# EAGLE schematic duikboot (EAGLE 9.5.2)
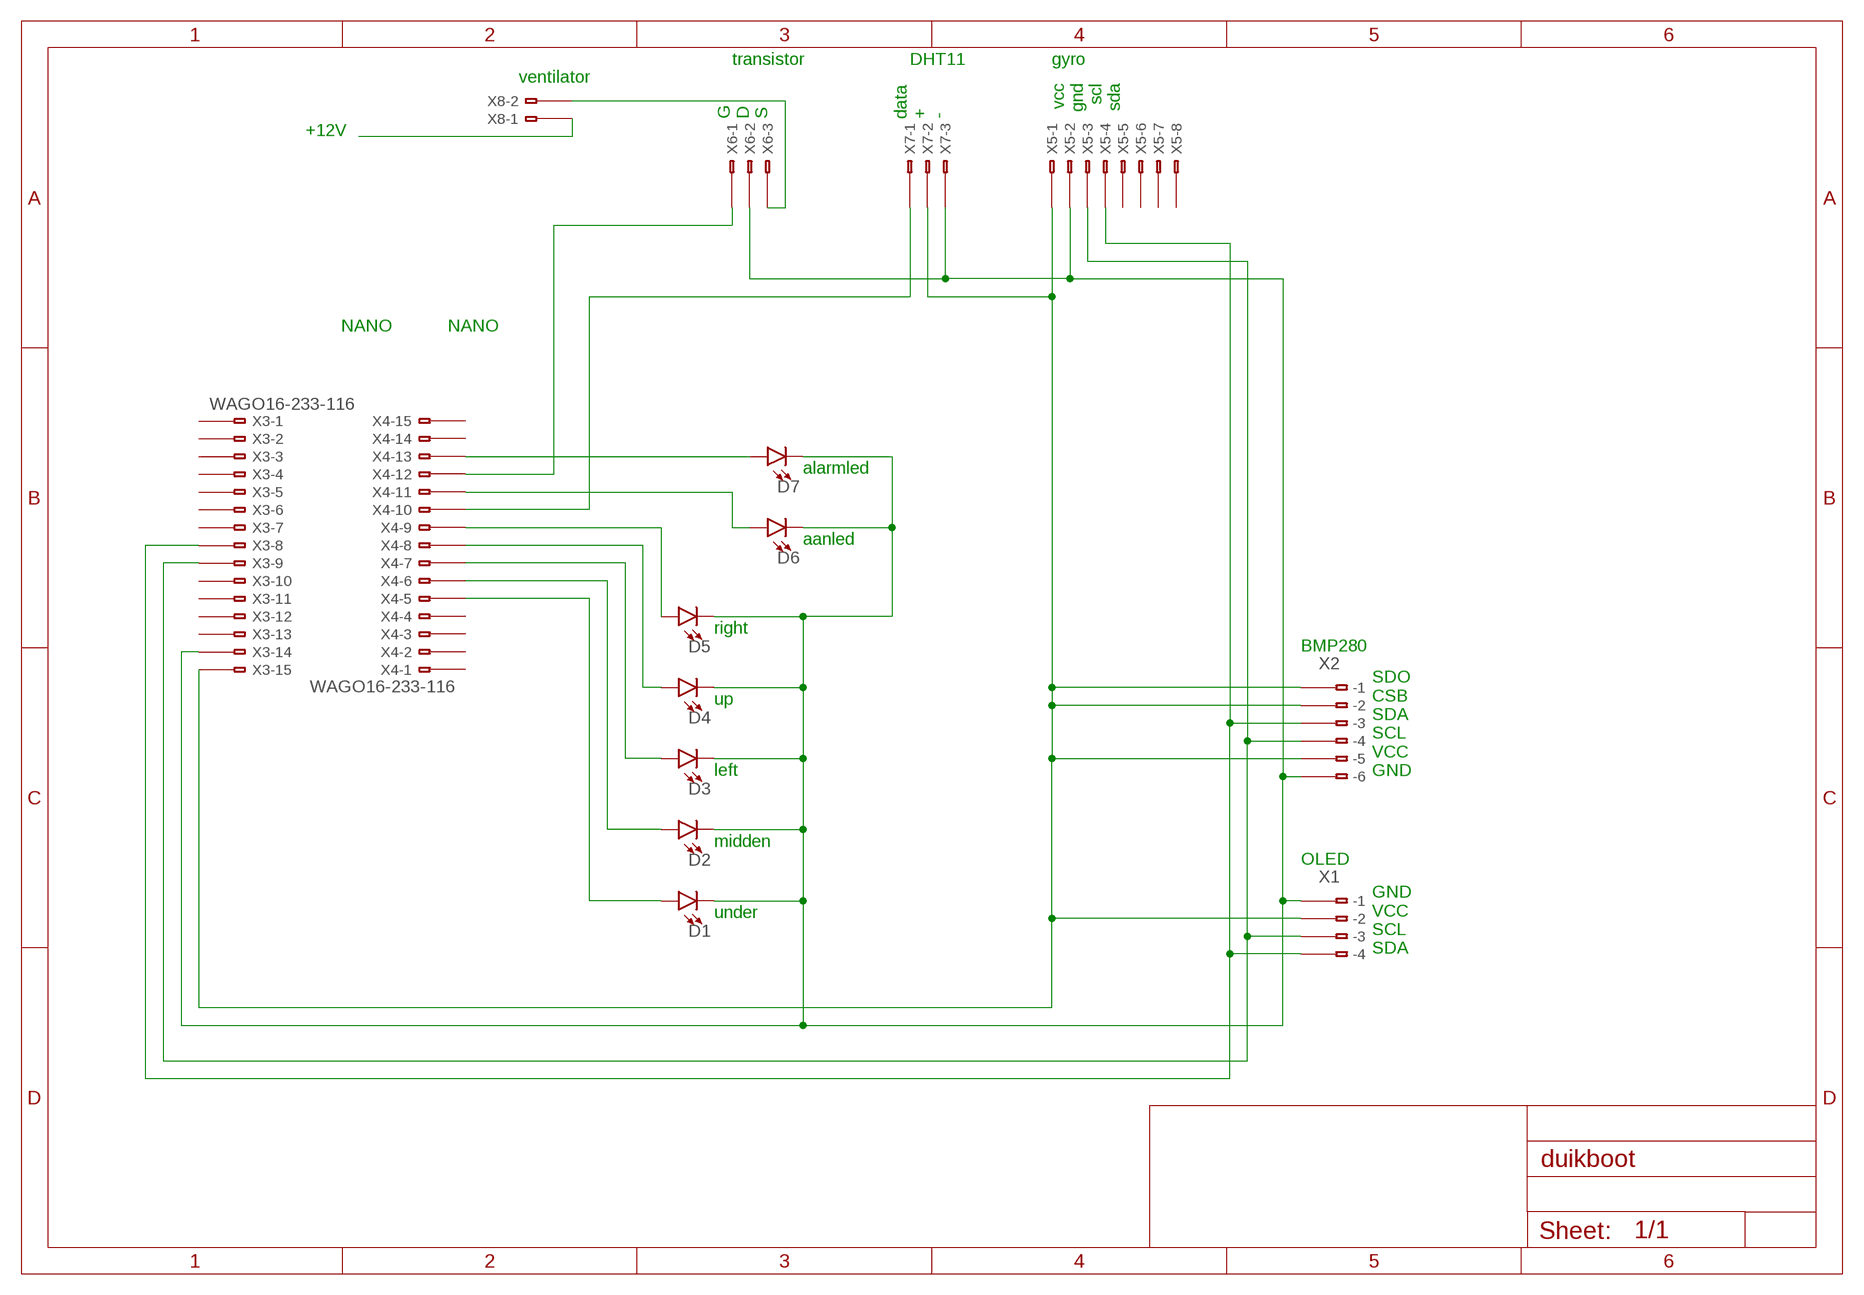
[diagram p0: schematic, sheet 1]

## Parts
D1  LED5MM  [LED_5MM]
D2  LED5MM  [LED_5MM]
D3  LED5MM  [LED_5MM]
D4  LED5MM  [LED_5MM]
D5  LED5MM  [LED_5MM]
D6  LED5MM  [LED_5MM]
D7  LED5MM  [LED_5MM]
X1  233-104  [233-104]
X2  233-106  [233-106]
X3  WAGO16-233-116  [233-116]
X4  WAGO16-233-116  [233-116]
X5  WAGO16-233-116  [233-116]
X6  WAGO16-233-116  [233-116]
X7  WAGO16-233-116  [233-116]
X8  WAGO16-233-116  [233-116]

## Nets
N$1: D1.K(C) D2.K(C) D3.K(C) D4.K(C) D5.K(C) D6.K(C) D7.K(C) X1.B1(B-1) X2.B6(B-6) X3.B14(-14:B1) X5.B2(-2:B1) X6.B2(-2:B1) X7.B3(-3:B1)
N$2: X1.B2(B-2) X2.B1(B-1) X2.B2(B-2) X2.B5(B-5) X3.B15(-15:B1) X5.B1(-1:B1) X7.B2(-2:B1)
N$3: X1.B3(B-3) X2.B4(B-4) X3.B9(-9:B1) X5.B3(-3:B1)
N$4: X4.B10(-10:B1) X7.B1(-1:B1)
N$5: X1.B4(B-4) X2.B3(B-3) X3.B8(-8:B1) X5.B4(-4:B1)
N$6: X4.B12(-12:B1) X6.B1(-1:B1)
N$7: X6.B3(-3:B1) X8.B2(-2:B1)
N$8: X8.B1(-1:B1)
N$9: D5.A X4.B9(-9:B1)
N$10: D4.A X4.B8(-8:B1)
N$11: D3.A X4.B7(-7:B1)
N$12: D2.A X4.B6(-6:B1)
N$13: D1.A X4.B5(-5:B1)
N$14: D6.A X4.B11(-11:B1)
N$15: D7.A X4.B13(-13:B1)
Unconnected: X1.A1(-1) X1.A2(-2) X1.A3(-3) X1.A4(-4) X2.A1(-1) X2.A2(-2) X2.A3(-3) X2.A4(-4) X2.A5(-5) X2.A6(-6) X3.A1(-1:A1) X3.A2(-2:A1) X3.A3(-3:A1) X3.A4(-4:A1) X3.A5(-5:A1) X3.A6(-6:A1) X3.A7(-7:A1) X3.A8(-8:A1) X3.A9(-9:A1) X3.A10(-10:A1) X3.A11(-11:A1) X3.A12(-12:A1) X3.A13(-13:A1) X3.A14(-14:A1) X3.A15(-15:A1) X3.A16(-16:A1) X3.B1(-1:B1) X3.B2(-2:B1) X3.B3(-3:B1) X3.B4(-4:B1) X3.B5(-5:B1) X3.B6(-6:B1) X3.B7(-7:B1) X3.B10(-10:B1) X3.B11(-11:B1) X3.B12(-12:B1) X3.B13(-13:B1) X3.B16(-16:B1) X4.A1(-1:A1) X4.A2(-2:A1) X4.A3(-3:A1) X4.A4(-4:A1) X4.A5(-5:A1) X4.A6(-6:A1) X4.A7(-7:A1) X4.A8(-8:A1) X4.A9(-9:A1) X4.A10(-10:A1) X4.A11(-11:A1) X4.A12(-12:A1) X4.A13(-13:A1) X4.A14(-14:A1) X4.A15(-15:A1) X4.A16(-16:A1) X4.B1(-1:B1) X4.B2(-2:B1) X4.B3(-3:B1) X4.B4(-4:B1) X4.B14(-14:B1) X4.B15(-15:B1) X4.B16(-16:B1) X5.A1(-1:A1) X5.A2(-2:A1) X5.A3(-3:A1) X5.A4(-4:A1) X5.A5(-5:A1) X5.A6(-6:A1) X5.A7(-7:A1) X5.A8(-8:A1) X5.A9(-9:A1) X5.A10(-10:A1) X5.A11(-11:A1) X5.A12(-12:A1) X5.A13(-13:A1) X5.A14(-14:A1) X5.A15(-15:A1) X5.A16(-16:A1) X5.B5(-5:B1) X5.B6(-6:B1) X5.B7(-7:B1) X5.B8(-8:B1) X5.B9(-9:B1) X5.B10(-10:B1) X5.B11(-11:B1) X5.B12(-12:B1) X5.B13(-13:B1) X5.B14(-14:B1) X5.B15(-15:B1) X5.B16(-16:B1) X6.A1(-1:A1) X6.A2(-2:A1) X6.A3(-3:A1) X6.A4(-4:A1) X6.A5(-5:A1) X6.A6(-6:A1) X6.A7(-7:A1) X6.A8(-8:A1) X6.A9(-9:A1) X6.A10(-10:A1) X6.A11(-11:A1) X6.A12(-12:A1) X6.A13(-13:A1) X6.A14(-14:A1) X6.A15(-15:A1) X6.A16(-16:A1) X6.B4(-4:B1) X6.B5(-5:B1) X6.B6(-6:B1) X6.B7(-7:B1) X6.B8(-8:B1) X6.B9(-9:B1) X6.B10(-10:B1) X6.B11(-11:B1) X6.B12(-12:B1) X6.B13(-13:B1) X6.B14(-14:B1) X6.B15(-15:B1) X6.B16(-16:B1) X7.A1(-1:A1) X7.A2(-2:A1) X7.A3(-3:A1) X7.A4(-4:A1) X7.A5(-5:A1) X7.A6(-6:A1) X7.A7(-7:A1) X7.A8(-8:A1) X7.A9(-9:A1) X7.A10(-10:A1) X7.A11(-11:A1) X7.A12(-12:A1) X7.A13(-13:A1) X7.A14(-14:A1) X7.A15(-15:A1) X7.A16(-16:A1) X7.B4(-4:B1) X7.B5(-5:B1) X7.B6(-6:B1) X7.B7(-7:B1) X7.B8(-8:B1) X7.B9(-9:B1) X7.B10(-10:B1) X7.B11(-11:B1) X7.B12(-12:B1) X7.B13(-13:B1) X7.B14(-14:B1) X7.B15(-15:B1) X7.B16(-16:B1) X8.A1(-1:A1) X8.A2(-2:A1) X8.A3(-3:A1) X8.A4(-4:A1) X8.A5(-5:A1) X8.A6(-6:A1) X8.A7(-7:A1) X8.A8(-8:A1) X8.A9(-9:A1) X8.A10(-10:A1) X8.A11(-11:A1) X8.A12(-12:A1) X8.A13(-13:A1) X8.A14(-14:A1) X8.A15(-15:A1) X8.A16(-16:A1) X8.B3(-3:B1) X8.B4(-4:B1) X8.B5(-5:B1) X8.B6(-6:B1) X8.B7(-7:B1) X8.B8(-8:B1) X8.B9(-9:B1) X8.B10(-10:B1) X8.B11(-11:B1) X8.B12(-12:B1) X8.B13(-13:B1) X8.B14(-14:B1) X8.B15(-15:B1) X8.B16(-16:B1)

## Notes on the sheet
- transistor | DHT11 | gyro
- ventilator
- vcc
  gnd
  scl
  sda
- G
  D
  S
- data
  +
  -
- +12V
- NANO | NANO
- alarmled
- aanled
- right
- BMP280
- up
- left
- SDO
  CSB
  SDA
  SCL
  VCC
  GND
- midden
- OLED
- under
- GND
  VCC
  SCL
  SDA

## Library data of the parts
D1-D7 = SparkFun-LED:LED: LED (Generic) Standard schematic elements and footprints for 5mm, 3mm, 1206, and 0603 sized LEDs. Generic LEDs with no color specified.
X1 = con-wago:233-104: WAGO Cage Clamp; MPN: 233-104; OC_FARNELL: unknown; OC_NEWARK: 28K9046
X2 = con-wago:233-106: WAGO Cage Clamp; MPN: 233-106; OC_FARNELL: unknown; OC_NEWARK: 28K9048
X3-X8 = con-wago:WAGO16-: WAGO Cage Clamp; MPN: 233-116; OC_FARNELL: unknown; OC_NEWARK: 28K9054